# Altium schematic sheet FPGA_Bank3.SchDoc
size B
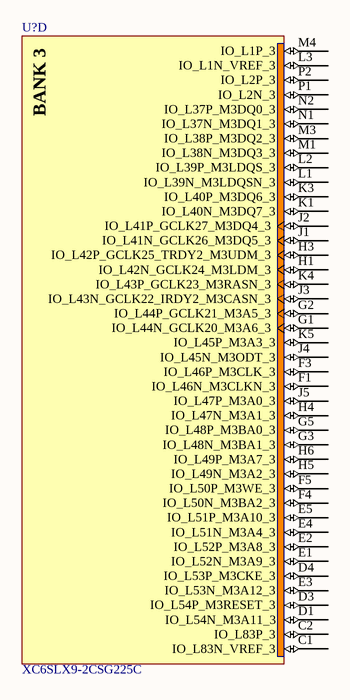
[diagram p0: FPGA_Bank3.SchDoc]

## Parts
U?  XC6SLX9-2CSG225C  [CSG225]  (part D of 7)

## Nets

Not connected (* = marked no-connect by the designer): U? C1(IO_L83N_VREF_3) C2(IO_L83P_3) D1(IO_L54N_M3A11_3) D3(IO_L54P_M3RESET_3) D4(IO_L53P_M3CKE_3) E1(IO_L52N_M3A9_3) E2(IO_L52P_M3A8_3) E3(IO_L53N_M3A12_3) E4(IO_L51N_M3A4_3) E5(IO_L51P_M3A10_3) F1(IO_L46N_M3CLKN_3) F3(IO_L46P_M3CLK_3) F4(IO_L50N_M3BA2_3) F5(IO_L50P_M3WE_3) G1(IO_L44N_GCLK20_M3A6_3) G2(IO_L44P_GCLK21_M3A5_3) G3(IO_L48N_M3BA1_3) G5(IO_L48P_M3BA0_3) H1(IO_L42N_GCLK24_M3LDM_3) H3(IO_L42P_GCLK25_TRDY2_M3UDM_3) H4(IO_L47N_M3A1_3) H5(IO_L49N_M3A2_3) H6(IO_L49P_M3A7_3) J1(IO_L41N_GCLK26_M3DQ5_3) J2(IO_L41P_GCLK27_M3DQ4_3) J3(IO_L43N_GCLK22_IRDY2_M3CASN_3) J4(IO_L45N_M3ODT_3) J5(IO_L47P_M3A0_3) K1(IO_L40N_M3DQ7_3) K3(IO_L40P_M3DQ6_3) K4(IO_L43P_GCLK23_M3RASN_3) K5(IO_L45P_M3A3_3) L1(IO_L39N_M3LDQSN_3) L2(IO_L39P_M3LDQS_3) L3(IO_L1N_VREF_3) M1(IO_L38N_M3DQ3_3) M3(IO_L38P_M3DQ2_3) M4(IO_L1P_3) N1(IO_L37N_M3DQ1_3) N2(IO_L37P_M3DQ0_3) P1(IO_L2N_3) P2(IO_L2P_3)

## Notes on the sheet
- (in symbol XC6SLX9-2CSG225C, part D) BANK 3

## Library data of the parts
U? = XC6SLX9-2CSG225C: Spartan-6 LX 1.2V FPGA, 160 User I/Os, 225-Ball Chip-Scale BGA (0.8mm Pitch), Speed Grade 2, Commercial Grade, Pb-Free; DatasheetVersion: ver1.6, Nov-2010; PackageVersion: ver1.1, Nov-2009; PackageReference: CSG225; PackageDescription: 225-Ball Chip-Scale BGA (CSG225) Package, 0.8 mm Pitch; Code_JEDEC: MO-275-HHAC-1; ComponentLink1Description: Manufacturer URL; ComponentLink1URL: http://www.xilinx.com/; ComponentLink2Description: Spartan-6 Datasheet; ComponentLink2URL: http://www.xilinx.com/support/documentation/data_sheets/ds160.pdf; ComponentLink3Description: Spartan-6 Documents; ComponentLink3URL: http://www.xilinx.com/support/documentation/spartan-6.htm